# Altium schematic sheet schematic_328.schdoc
size 294 x 204 mm
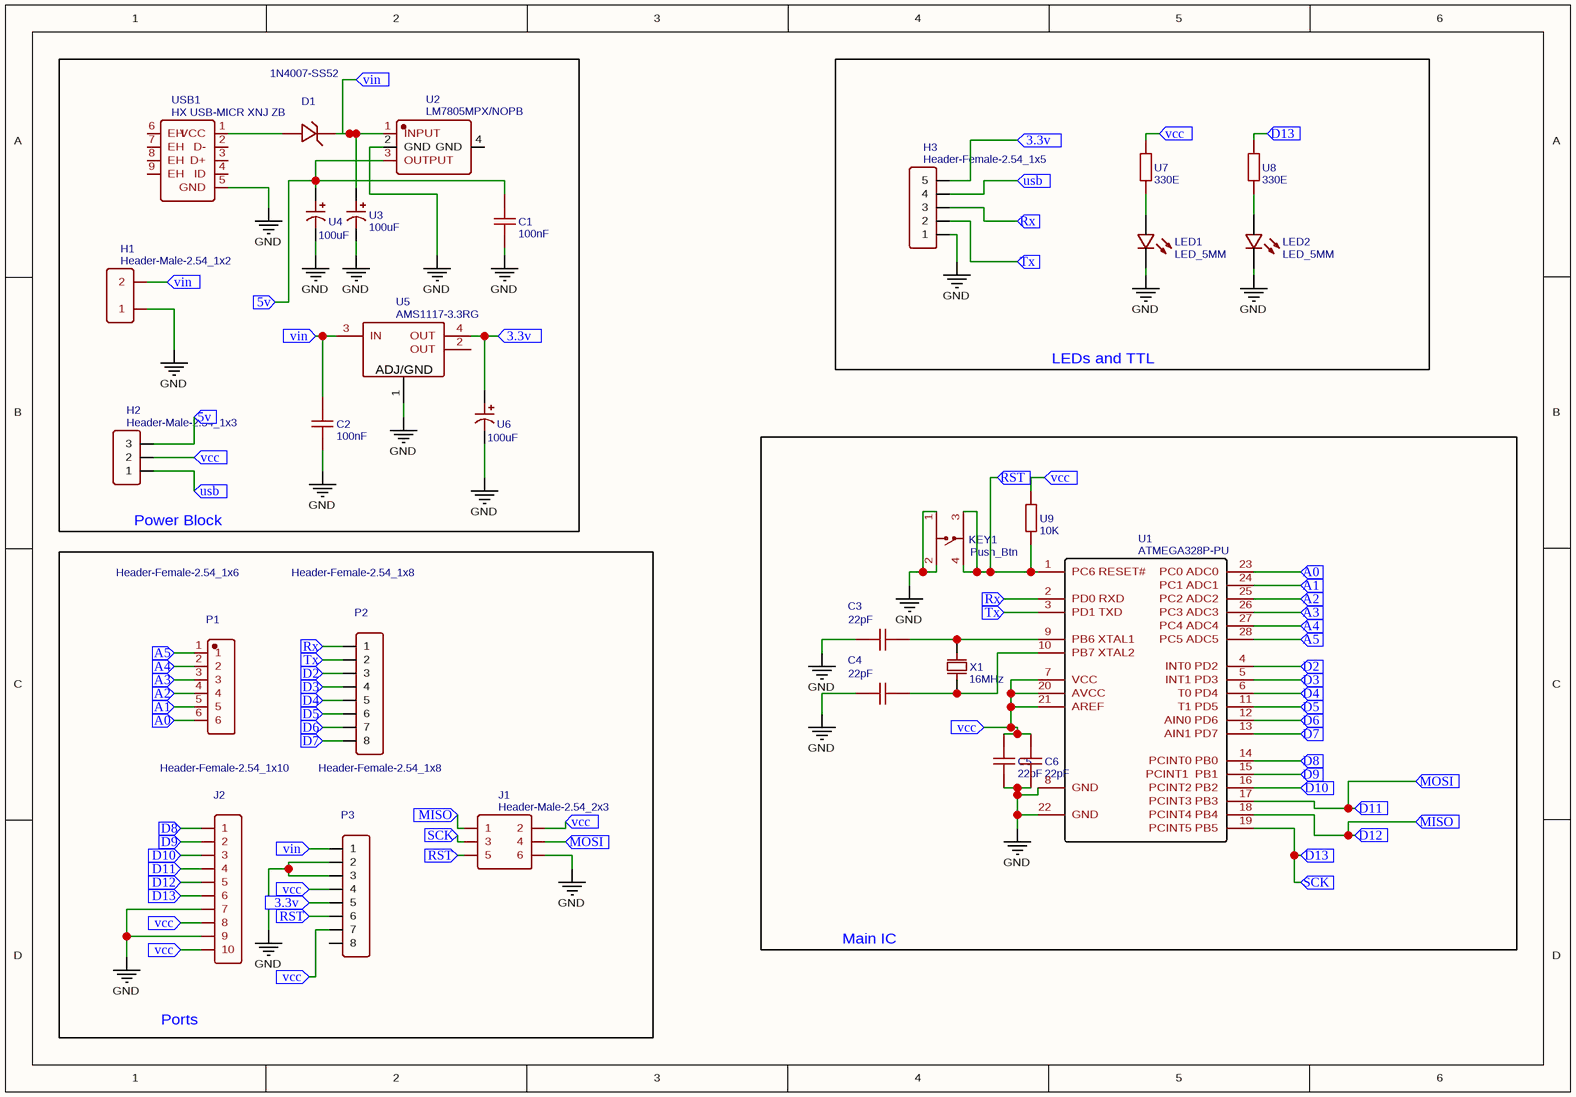
[diagram p0: schematic_328.schdoc]

## Parts
C1  100nF  [C1206]
C2  100nF  [C1206]
C3  22pF  [C1206]
C4  22pF  [C1206]
C5  22pF  [C1206]
C6  22pF  [C1206]
D1  1N4007-SS52  [SMB_L4.3-W3.6-LS5.4-RD]
H1  Header-Male-2.54_1x2  [HDR-TH_2P-P2.54-V-M-1]
H2  Header-Male-2.54_1x3  [HDR-TH_3P-P2.54-V-M-1]
H3  Header-Female-2.54_1x5  [HDR-TH_5P-P2.54-V-F]
J1  Header-Male-2.54_2x3  [HDR-TH_6P-P2.54-V-M-R2-C3-S2.54-1]
J2  Header-Female-2.54_1x10  [HDR-TH_10P-P2.54-V-F]
KEY1  Push_Btn  [SW-SMD_4P-L6.0-W6.0-P4.50-LS10.0_TL3301EF160QG]
LED1  LED_5MM  [LED-TH_BD5.0-P2.54-FD_C9900023552]
LED2  LED_5MM  [LED-TH_BD5.0-P2.54-FD_C9900023552]
P1  Header-Female-2.54_1x6  [HDR-TH_6P-P2.54-V-F]
P2  Header-Female-2.54_1x8  [HDR-TH_8P-P2.54-V-F-1]
P3  Header-Female-2.54_1x8  [HDR-TH_8P-P2.54-V-F-1]
U1  ATMEGA328P-PU  [DIP-28_L34.6-W7.3-P2.54-LS10.2-BL]
U2  LM7805MPX/NOPB  [SOT-223-4_L6.5-W3.5-P2.30-LS7.0-BR]
U3  100uF  [CAP-TH_BD5.0-P2.00-D0.5-FD]
U4  100uF  [CAP-TH_BD5.0-P2.00-D0.5-FD]
U5  AMS1117-3.3RG  [SOT-223-3_L6.4-W3.5-P2.30-LS7.0-BR]
U6  100uF  [CAP-TH_BD5.0-P2.00-D0.5-FD]
U7  330E  [R1206]
U8  330E  [R1206]
U9  10K  [R1206]
USB1  HX USB-MICR XNJ ZB  [MICRO-USB-SMD_HX-USB-MICRO-XNJ-JB]
X1  16MHz  [HC-49US_L11.0-W4.6-P4.88]

## Blocks framed on the sheet
Power Block: C1 C2 D1 H1 H2 U2-U6 USB1
LEDs and TTL: H3 LED1 LED2 U7 U8
Main IC: C3-C6 KEY1 U1 U9 X1
Ports: J1 J2 P1-P3

## Ports
3.3v (in), 5v (in), A0 (in), A1 (in), A2 (in), A3 (in), A4 (in), A5 (in), D2 (in), D3 (in), D4 (in), D5 (in), D6 (in), D7 (in), D8 (in), D9 (in), D10 (in), D11 (in), D12 (in), D13 (in), MISO (in), MOSI (in), RST (in), Rx (in), SCK (in), Tx (in), usb (in), vcc (in), vin (in)

## Nets
GND: C1.1 C2.1 C3.2 C4.2 C5.2 C6.2 H1.1 H3.1 J1.6 J2.7 J2.9 KEY1.1 KEY1.2 LED1.2(K) LED2.2(K) P3.2 P3.3 U1.8(GND) U1.22(GND) U2.2(GND) U3.2 U4.2 U5.1(ADJ/GND) U6.2 USB1.5(GND)
3.3v: H3.5 P3.5 U5.4(OUT) U6.1 ; port 3.3v
5v: C1.2 H2.3 U2.3(OUTPUT) U4.1 ; port 5v
A0: P1.6 U1.23(PC0_ADC0) ; port A0
A1: P1.5 U1.24(PC1_ADC1) ; port A1
A2: P1.4 U1.25(PC2_ADC2) ; port A2
A3: P1.3 U1.26(PC3_ADC3) ; port A3
A4: P1.2 U1.27(PC4_ADC4) ; port A4
A5: P1.1 U1.28(PC5_ADC5) ; port A5
D2: P2.3 U1.4(INT0_PD2) ; port D2
D3: P2.4 U1.5(INT1_PD3) ; port D3
D4: P2.5 U1.6(T0_PD4) ; port D4
D5: P2.6 U1.11(T1_PD5) ; port D5
D6: P2.7 U1.12(AIN0_PD6) ; port D6
D7: P2.8 U1.13(AIN1_PD7) ; port D7
D8: J2.1 U1.14(PCINT0_PB0) ; port D8
D9: J2.2 U1.15(PCINT1__PB1) ; port D9
D10: J2.3 U1.16(PCINT2_PB2) ; port D10
D11: J1.4 J2.4 U1.17(PCINT3_PB3) ; port D11, port MOSI
D12: J1.1 J2.5 U1.18(PCINT4_PB4) ; port D12, port MISO
D13: J1.3 J2.6 U1.19(PCINT5_PB5) U8.2 ; port D13, port SCK
RST: J1.5 KEY1.3 KEY1.4 P3.6 U1.1(PC6_RESET#) U9.1 ; port RST
Rx: H3.3 P2.1 U1.2(PD0_RXD) ; port Rx
Tx: H3.2 P2.2 U1.3(PD1_TXD) ; port Tx
usb: H2.1 H3.4 ; port usb
vcc: C5.1 C6.1 H2.2 J1.2 J2.8 J2.10 P3.4 P3.7 U1.7(VCC) U1.20(AVCC) U1.21(AREF) U7.2 U9.2 ; port vcc
vin: C2.2 D1.1(C) H1.2 P3.1 U2.1(INPUT) U3.1 U5.3(IN) ; port vin
NetC3_1: C3.1 U1.9(PB6_XTAL1) X1.2(OSC2)
NetC4_1: C4.1 U1.10(PB7_XTAL2) X1.1(OSC1)
NetD1_2: D1.2(A) USB1.1(VCC)
NetLED1_1: LED1.1(A) U7.1
NetLED2_1: LED2.1(A) U8.1

Not connected (* = marked no-connect by the designer): P3 8; U2 4(GND); U5 2(OUT); USB1 2(D-) 3(D+) 4(ID) 6(EH) 7(EH) 8(EH) 9(EH)

## Library data of the parts
C1 C2 = 100nF: Manufacturer: HRE(芯声); Manufacturer Part: CGA1206X7R104K251NT; nameAlias: Value; Contributor: lcsc; Supplier: LCSC; Supplier Part: C7503480; spicePre: C; spiceSymbolName: CGA1206X7R104K251NT
C3-C6 = 22pF: Manufacturer: HRE(芯声); Manufacturer Part: CGA1206X7R104K251NT; nameAlias: Value; Contributor: lcsc; Supplier: LCSC; Supplier Part: C7503480; spicePre: C; spiceSymbolName: CGA1206X7R104K251NT
D1 = 1N4007-SS52: Manufacturer: null; Contributor: LCSC; Supplier: LCSC; Supplier Part: C9900003651; Manufacturer Part: 1N4007-SS52; spicePre: D; spiceSymbolName: 1N4007-SS52
H1 = Header-Male-2.54_1x2: Manufacturer: TE Connectivity(泰科电子); Manufacturer Part: 826629-2; Supplier: LCSC; Supplier Part: C86471; JLCPCB Part Class: Extended Part; spicePre: H; spiceSymbolName: Header-Male-2.54_1x2
H2 = Header-Male-2.54_1x3: Manufacturer: BOOMELE(博穆精密); Manufacturer Part: 2.54-1*3P针; Supplier: LCSC; Supplier Part: C49257; JLCPCB Part Class: Extended Part; spicePre: H; spiceSymbolName: Header-Male-2.54_1x3
H3 = Header-Female-2.54_1x5: Manufacturer: BOOMELE(博穆精密); Manufacturer Part: 2.54-1*5P母; Supplier: LCSC; Supplier Part: C50950; JLCPCB Part Class: Extended Part; spicePre: H; spiceSymbolName: Header-Female-2.54_1x5
J1 = Header-Male-2.54_2x3: Manufacturer: BOOMELE(博穆精密); Manufacturer Part: 2.54-2*3P针; Supplier: LCSC; Supplier Part: C65114; JLCPCB Part Class: Extended Part; spicePre: J; spiceSymbolName: Header-Male-2.54_2x3
J2 = Header-Female-2.54_1x10: Manufacturer: BOOMELE(博穆精密); Manufacturer Part: 2.54-1*10P母; Supplier: LCSC; Supplier Part: C35445; JLCPCB Part Class: Extended Part; spicePre: J; spiceSymbolName: Header-Female-2.54_1x10
KEY1 = Push_Btn: Manufacturer: null; Manufacturer Part: 4pinTACTPCBTHTPushButton; Contributor: LCSC; Supplier: LCSC; Supplier Part: C9900003768; spicePre: K; spiceSymbolName: 4PINTACTPCBTHTPUSHBUTTON
LED1 LED2 = LED_5MM: Manufacturer: null; Contributor: lcsc; Supplier: LCSC; Supplier Part: C9900023552; Manufacturer Part: LED_5MM; JLCPCB Part Class: Extended Part; spicePre: L; spiceSymbolName: LED_5MM
P1 = Header-Female-2.54_1x6: Manufacturer: BOOMELE(博穆精密); Manufacturer Part: 2.54-1*6P母; Supplier: LCSC; Supplier Part: C40877; JLCPCB Part Class: Extended Part; spicePre: P; spiceSymbolName: Header-Female-2.54_1x6
P2 P3 = Header-Female-2.54_1x8: Manufacturer: BOOMELE(博穆精密); Manufacturer Part: 2.54-1*8P母环保; Supplier: LCSC; Supplier Part: C27438; JLCPCB Part Class: Extended Part; spicePre: P; spiceSymbolName: Header-Female-2.54_1x8
U1 = ATMEGA328P-PU: Manufacturer: MICROCHIP(美国微芯); sourceId: Oic6oiASL; Contributor: LCSC; timeStamp: 1451725987; Supplier: LCSC; Manufacturer Part: ATMEGA328P-PU; Supplier Part: C33901; JLCPCB Part Class: Extended Part; spicePre: U; spiceSymbolName: ATMEGA328P-PU
U2 = LM7805MPX/NOPB: Manufacturer: TI(德州仪器); Contributor: LCSC; Supplier: LCSC; Supplier Part: C2848241; Manufacturer Part: LM7805MPX/NOPB; JLCPCB Part Class: Extended Part; spicePre: U; spiceSymbolName: LM7805MPX/NOPB
U3 U4 U6 = 100uF: Manufacturer: rubycon(红宝石); Manufacturer Part: 25YXS100MEFC5X11; Contributor: lcsc; nameAlias: Value; Supplier: LCSC; Supplier Part: C5114700; spicePre: U; spiceSymbolName: 25YXS100MEFC5X11
U5 = AMS1117-3.3RG: Manufacturer: HGC(深圳汉芯); Contributor: lcsc; Supplier: LCSC; Supplier Part: C2977152; Manufacturer Part: AMS1117-3.3RG; JLCPCB Part Class: Extended Part; spicePre: U; spiceSymbolName: AMS1117-3.3RG
U7 U8 = 330E: Manufacturer: null; Manufacturer Part: 4703-1206; Contributor: lcsc; Supplier: LCSC; Supplier Part: C9900013564; JLCPCB Part Class: Extended Part; spicePre: U; spiceSymbolName: 4703-1206
U9 = 10K: Manufacturer: null; Manufacturer Part: 4703-1206; Contributor: lcsc; Supplier: LCSC; Supplier Part: C9900013564; JLCPCB Part Class: Extended Part; spicePre: U; spiceSymbolName: 4703-1206
USB1 = HX USB-MICR XNJ ZB: Manufacturer: hanxia(韩下); Contributor: lcsc; Supplier: LCSC; Supplier Part: C18357557; Manufacturer Part: HX USB-MICR XNJ ZB; spicePre: U; spiceSymbolName: HX USB-MICR XNJ ZB
X1 = 16MHz: Manufacturer: JGHC(晶光华); Manufacturer Part: 49SAC16000202060; nameAlias: Value; Contributor: LCSC; Supplier: LCSC; Supplier Part: C390745; JLCPCB Part Class: Extended Part; spicePre: X; spiceSymbolName: 49SAC16000202060